# EAGLE design PicDisc-card (EAGLE 9.3.2)
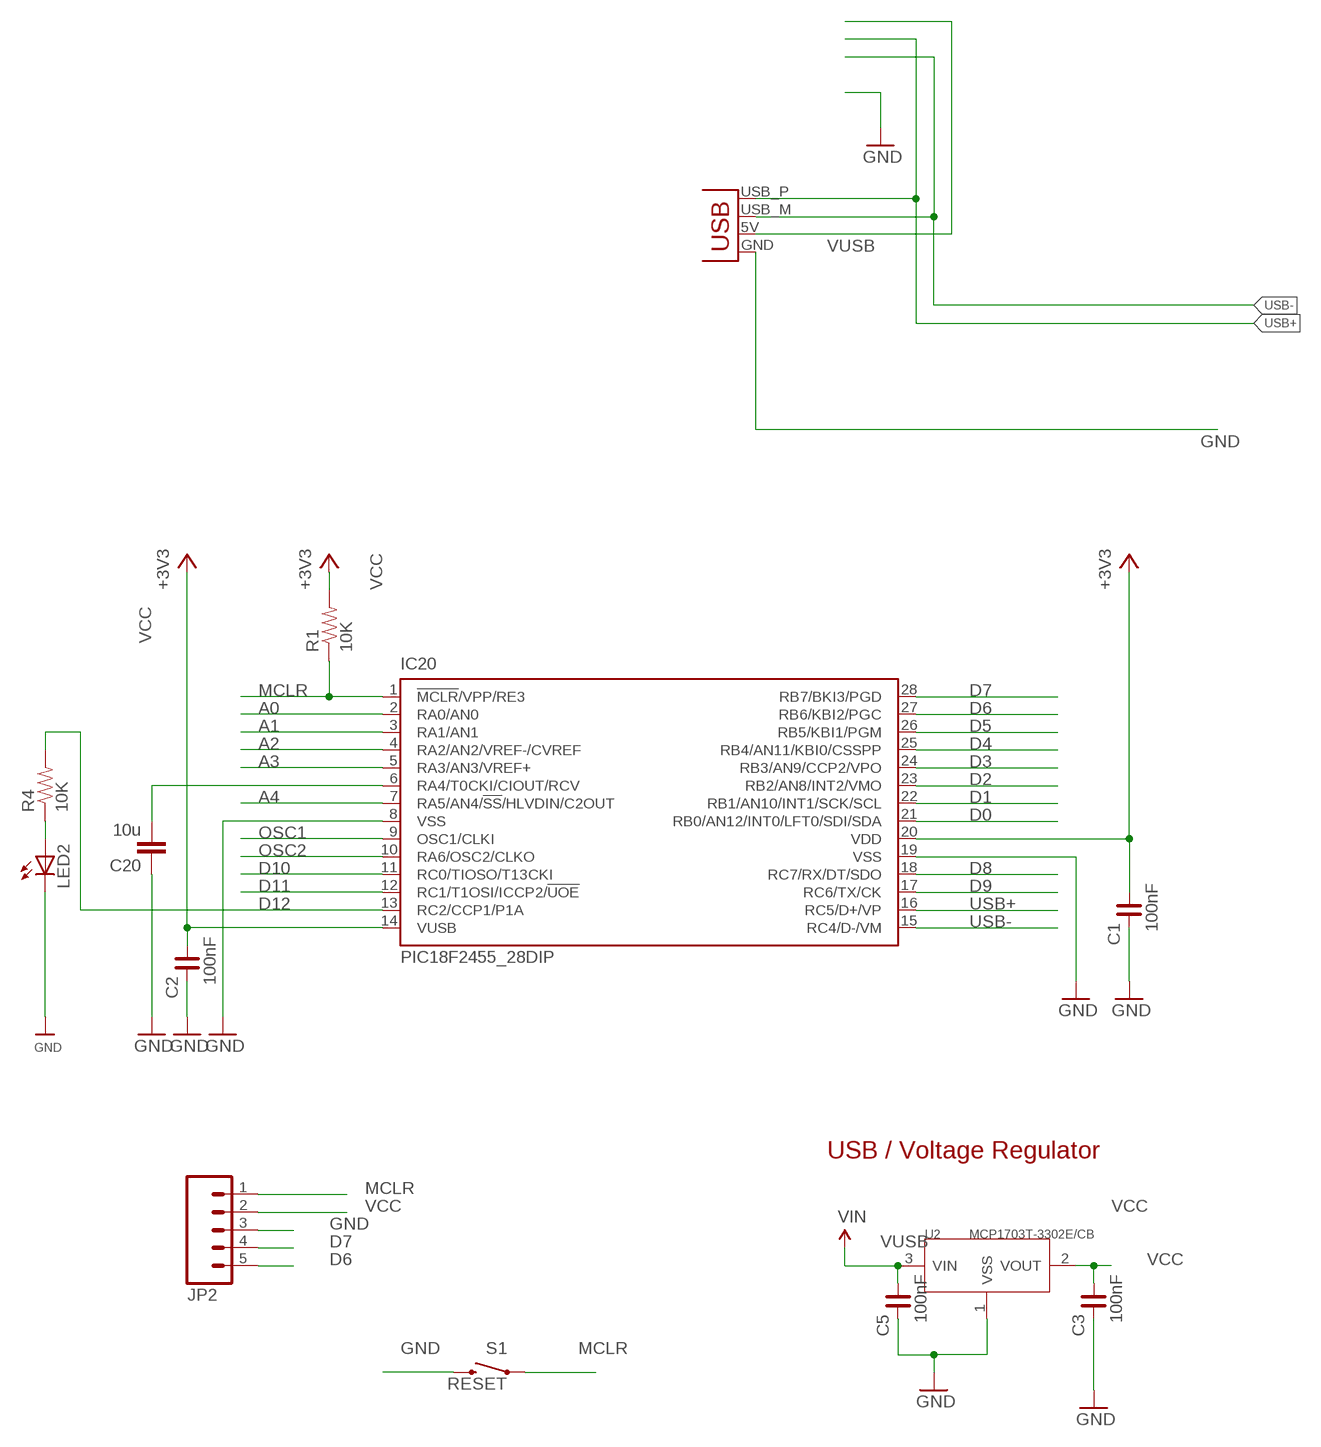
[diagram p0: schematic, sheet 1]

## Parts
C1  100nF  C_0603  [C0603]
C2  100nF  C_0603  [C0603]
C3  100nF  C_0603  [C0603]
C5  100nF  C_0603  [C0603]
C20  10u  CC0805  [C0805]
IC20  PIC18F2455_28DIP  [DIL28-3]
JP2  M05NO_SILK  [1X05_NO_SILK]
JP3  USBPCB  [USB-A-PCB]
LED2  LEDCHIPLED_0805  [CHIPLED_0805]
R1  10K  10KOHM-1/10W-1%(0603)0603  [0603-RES]
R4  10K  10KOHM-1/10W-1%(0603)0603  [0603-RES]
S1  RESET  SWITCH-MOMENTARY-2SMD-REDUNDANT  [TACTILE-SWITCH-SMD]
U2  MCP1703T-3302E/CB  XC6206  [SOT23]

## Nets
A0: IC20.2(RA0/AN0)
A1: IC20.3(RA1/AN1)
A2: IC20.4(RA2/AN2/VREF-/CVREF)
A3: IC20.5(RA3/AN3/VREF+)
A4: IC20.7(RA5/AN4/!SS!/HLVDIN/C2OUT)
D0: IC20.21(RB0/AN12/INT0/LFT0/SDI/SDA)
D1: IC20.22(RB1/AN10/INT1/SCK/SCL)
D2: IC20.23(RB2/AN8/INT2/VMO)
D3: IC20.24(RB3/AN9/CCP2/VPO)
D4: IC20.25(RB4/AN11/KBI0/CSSPP)
D5: IC20.26(RB5/KBI1/PGM)
D6: IC20.27(RB6/KBI2/PGC) JP2.5
D7: IC20.28(RB7/BKI3/PGD) JP2.4
D8: IC20.18(RC7/RX/DT/SDO)
D9: IC20.17(RC6/TX/CK)
D10: IC20.11(RC0/TIOSO/T13CKI)
D11: IC20.12(RC1/T1OSI/ICCP2/!UOE)
D12: IC20.13(RC2/CCP1/P1A) R4.2
GND [GND]: C1.2 C2.2 C3.2 C5.2 C20.1 IC20.8(VSS) IC20.19(VSS) JP2.3 JP3.GND LED2.C S1.3 S1.4 U2.1(VSS)
MCLR: IC20.1(!MCLR!/VPP/RE3) JP2.1 R1.1 S1.1 S1.2
N$1: LED2.A R4.1
N$15: C20.2 IC20.6(RA4/T0CKI/CIOUT/RCV)
OSC1: IC20.9(OSC1/CLKI)
OSC2: IC20.10(RA6/OSC2/CLKO)
USB+: IC20.16(RC5/D+/VP) JP3.USB_P(D+)
USB-: IC20.15(RC4/D-/VM) JP3.USB_M(D-)
VCC: C1.1 C2.1 C3.1 IC20.14(VUSB) IC20.20(VDD) JP2.2 R1.2 U2.2(VOUT) ; supply symbol labelled +3V3
VUSB: C5.1 JP3.5V(VBUS) U2.3(VIN) ; supply symbol labelled VIN

## Notes on the sheet
- USB / Voltage Regulator

## Library data of the parts
C1-C3 C5 = rc-master-smd:C_: NON-POLARIZED CAP
C20 = 00Capacitor:C: Capacitor
IC20 = microchip:PIC18F2*_28: USB Microcontrollers with nanoWatt Technology High-Performance, Enhanced Flash, 28/40/44-Pin, Source: http://ww1.microchip.com/downloads/en/devicedoc/39632c.pdf; MF: MICROCHIP; MPN: PIC18F2455-I/SP; OC_FARNELL: 1579600; OC_NEWARK: 01M8485
JP2 = SparkFun-Connectors:M05: Header 5 Standard 5-pin 0.1" header. Use with straight break away headers (SKU : PRT-00116), right angle break away headers (PRT-00553), swiss pins (PRT-00743), machine pins (PRT-00117), and female headers (PRT-00115). Molex polarized connector foot print use with SKU : PRT-08230 with associated crimp pins and housings.
JP3 = SparkFun-Connectors:USB: USB Connectors USB-B-PTH is fully proven SKU : PRT-00139/CONN-08278 USB-miniB is fully proven SKU : PRT-00587 USB-A-PCB is untested. USB-A-H is throughly reviewed, but untested. Spark Fun Electronics SKU : PRT-00437 USB-B-SMT is throughly reviewed, but untested. Needs silkscreen touching up. USB-A-S has not been used/tested USB-MB-H has not been used/tested USB-MICROB has been used. CONN-09505
LED2 = led:LED: LED OSRAM: - CHIPLED LG R971, LG N971, LY N971, LG Q971, LY Q971, LO R971, LY R971 LH N974, LH R974 LS Q976, LO Q976, LY Q976 LO Q996 - Hyper CHIPLED LW Q18S LB Q993, LB Q99A, LB R99A - SideLED LS A670, LO A670, LY A670, LG A670, LP A670 LB A673, LV A673, LT A673, LW A673 LH A674 LY A675 LS A676, LA A676, LO A676, LY A676, LW A676 LS A679, LY A679, LG A679 - Hyper Micro SIDELED® LS Y876, LA Y876, LO Y876, LY Y876 LT Y87S - SmartLED LW L88C, LW L88S LB L89C, LB L89S, LG L890 LS L89K, LO L89K, LY L89K LS L896, LA L896, LO L896, LY L896 - TOPLED LS T670, LO T670, LY T670, LG T670, LP T670 LSG T670, LSP T670, LSY T670, LOP T670, LYG T670 LG T671, LOG T671, LSG T671 LB T673, LV T673, LT T673, LW T673 LH T674 LS T676, LA T676, LO T676, LY T676, LB T676, LH T676, LSB T676, LW T676 LB T67C, LV T67C, LT T67C, LS T67K, LO T67K, LY T67K, LW E67C LS E67B, LA E67B, LO E67B, LY E67B, LB E67C, LV E67C, LT E67C LW T67C LS T679, LY T679, LG T679 LS T770, LO T770, LY T770, LG T770, LP T770 LB T773, LV T773, LT T773, LW T773 LH T774 LS E675, LA E675, LY E675, LS T675 LS T776, LA T776, LO T776, LY T776, LB T776 LHGB T686 LT T68C, LB T68C - Hyper Mini TOPLED® LB M676 - Mini TOPLED Santana® LG M470 LS M47K, LO M47K, LY M47K Source: http://www.osram.convergy.de LUXEON: - LUMILED® LXK2-PW12-R00, LXK2-PW12-S00, LXK2-PW14-U00, LXK2-PW14-V00 LXK2-PM12-R00, LXK2-PM12-S00, LXK2-PM14-U00 LXK2-PE12-Q00, LXK2-PE12-R00, LXK2-PE12-S00, LXK2-PE14-T00, LXK2-PE14-U00 LXK2-PB12-K00, LXK2-PB12-L00, LXK2-PB12-M00, LXK2-PB14-N00, LXK2-PB14-P00, LXK2-PB14-Q00 LXK2-PR12-L00, LXK2-PR12-M00, LXK2-PR14-Q00, LXK2-PR14-R00 LXK2-PD12-Q00, LXK2-PD12-R00, LXK2-PD12-S00 LXK2-PH12-R00, LXK2-PH12-S00 LXK2-PL12-P00, LXK2-PL12-Q00, LXK2-PL12-R00 Source: www.luxeon.com KINGBRIGHT: KA-3528ASYC Source: www.kingbright.com
R1 R4 = SparkFun-Resistors:10KOHM-1/10W-1%(0603): RES-00824; PROD_ID: RES-00824
S1 = SparkFun-Electromechanical:SWITCH-MOMENTARY-2: Various NO switches- pushbuttons, reed, etc; PROD_ID: SWCH-08247
U2 = xc6206:XC6206

## Net classes
0 default: width 0.203 mm, drill 0.356 mm, clearance 0.203 mm
1 vcc: width 0.203 mm, drill 0.356 mm, clearance 0.203 mm
2 GND: width 0.203 mm, drill 0.356 mm, clearance 0.203 mm

## Board
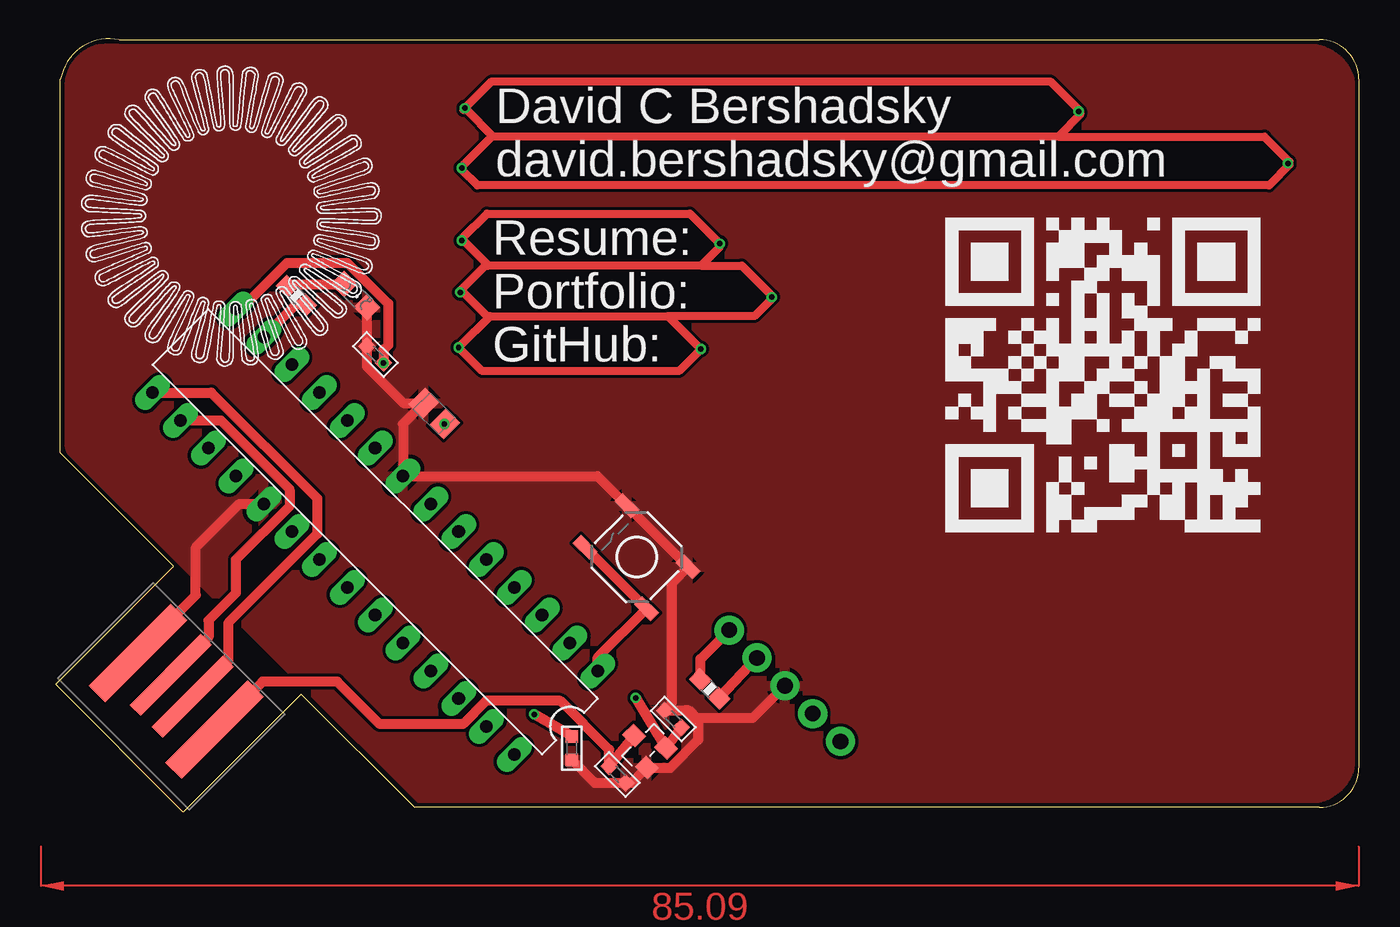
[diagram p1: board, top side]
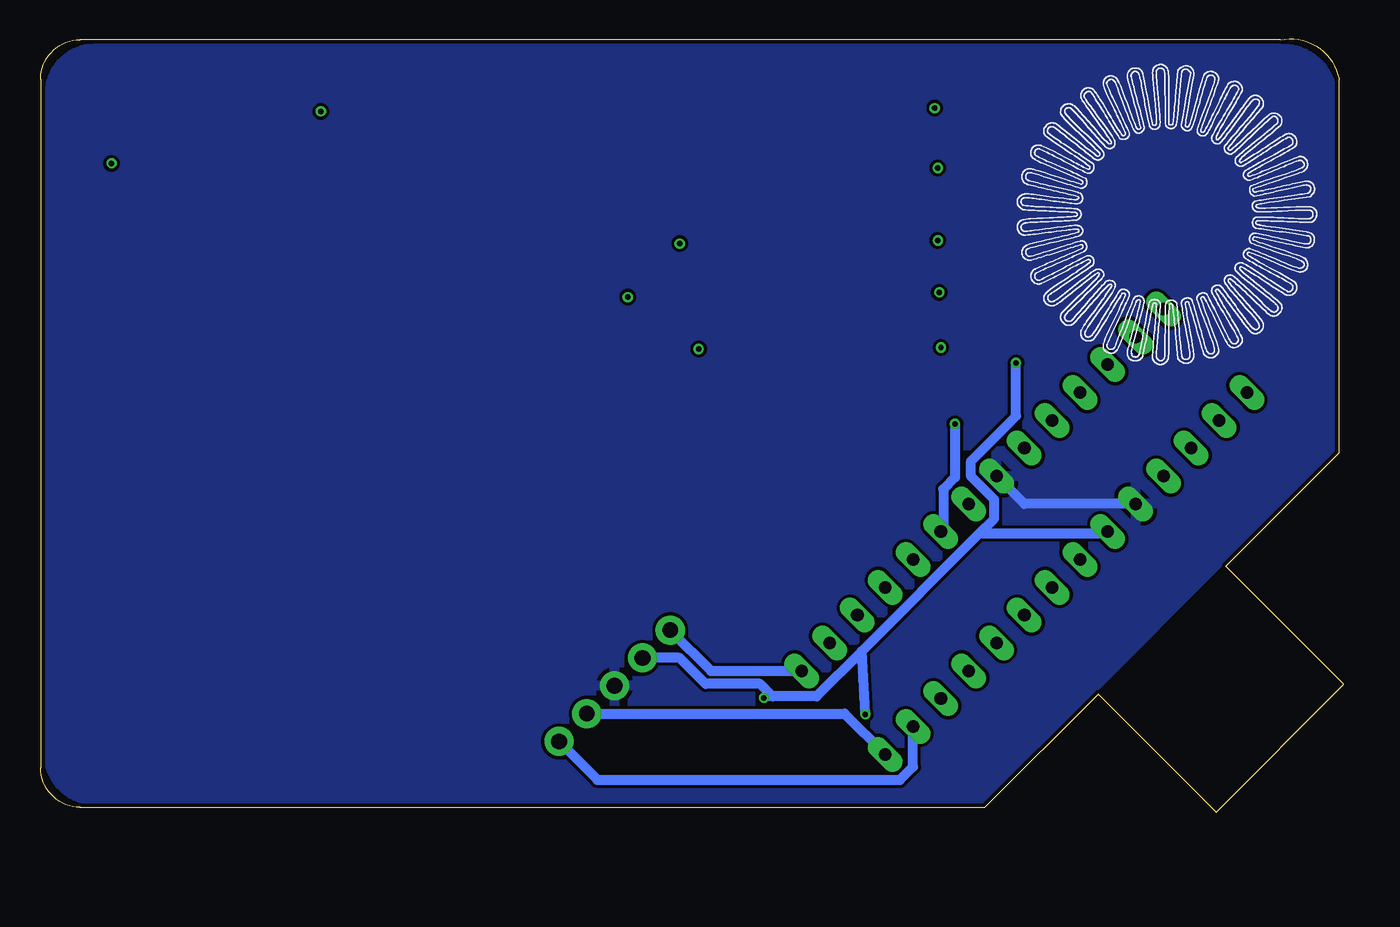
[diagram p2: board, bottom side, seen from below]

Size 84.14 x 49.91 mm. Coordinates in mm from the lower left corner, seen from the top.
Outline: 84.14,47.31 84.14,2.86 arc-90 81.6,0.32 23.18,0.32 15.88,7.62 8.25,0 0,8.26 7.62,15.87 0.32,23.18 0.32,47.31 arc-90 4.13,49.85 81.6,49.85 arc-90 84.14,47.31
Copper layers (1*16): Top 0.035mm / dielectric 1.5mm / Bottom 0.035mm
Design rules "dirt_cheap_dirty_boards.v1": minimum track width 5mil, minimum drill 12mil, track to track 5mil, track to pad 5mil, pad to pad 5mil, via to via 5mil, smd to smd 0mil, copper to edge 10mil, drill to drill 10mil, minimum pad ring 10mil, minimum via ring 6mil, stop-mask expansion 2mil, vias tented up to drill 25mil, thermal gap 10mil

### Footprints (pad centres in the part's own frame; a part is rotated, then mirrored left to right if it is on the bottom)
C0603 = smd 0.8 x 0.8: 1 -0.762,0; 2 0.762,0
C0805 = smd 1.3 x 1.5: 1 -0.95,0; 2 0.95,0
DIL28-3 = drill 0.813 long: 1 -16.51,-3.81; 2 -13.97,-3.81; 3 -11.43,-3.81; 4 -8.89,-3.81; 5 -6.35,-3.81; 6 -3.81,-3.81; 7 -1.27,-3.81; 8 1.27,-3.81; 9 3.81,-3.81; 10 6.35,-3.81; 11 8.89,-3.81; 12 11.43,-3.81; 13 13.97,-3.81; 14 16.51,-3.81; 15 16.51,3.81; 16 13.97,3.81; 17 11.43,3.81; 18 8.89,3.81; 19 6.35,3.81; 20 3.81,3.81; 21 1.27,3.81; 22 -1.27,3.81; 23 -3.81,3.81; 24 -6.35,3.81; 25 -8.89,3.81; 26 -11.43,3.81; 27 -13.97,3.81; 28 -16.51,3.81
1X05_NO_SILK = drill 1.016 pad 1.88: 1 0,0; 2 2.54,0; 3 5.08,0; 4 7.62,0; 5 10.16,0
USB-A-PCB = smd 7.5 x 1.5: 5V -0.2,-3.5; GND -0.2,3.5 | smd 6.5 x 1: USB_M 0.3,-1; USB_P 0.3,1
CHIPLED_0805 = smd 1.2 x 1.2: A 0,-1.05; C 0,1.05
0603-RES = smd 1.1 x 1: 1 -0.85,0; 2 0.85,0
TACTILE-SWITCH-SMD = smd 1.524 x 0.762: 1 -2.794,1.905; 2 2.794,1.905; 3 -2.794,-1.905; 4 2.794,-1.905
SOT23 = smd 1.016 x 1.143: 1 -0.889,-1.016; 2 0.889,-1.016; 3 0,1.016

### Placement (x,y rotation side)
C1  33.34,4.13 270 top
C2  20.64,29.53 135 top
C3  39.87,6.01 135 top
C5  36.28,2.42 315 top
C20  24.45,25.72 315 top
IC20  20.64,18.1 135 top
JP2  43.5,11.75 315 top
JP3  7.94,7.94 45 top
LED2  19.37,33.34 225 top
R1  42.23,7.94 315 top
R4  15.56,33.34 315 top
S1  37.52,16.46 135 top
U2  38.07,4.22 45 top

### Tracks (layer width: path | path; a pad name or v marks a point on that pad's centre or on a via)
D6
  Bottom 0.635: JP2.5 48.2,2.08 28.66,2.08 27.82,2.92 IC20.27 | JP2.5 | IC20.27
D7
  Bottom 0.635: JP2.4 32.25,6.36 IC20.28 | JP2.4 | IC20.28
D12
  Top 0.635: R4.2 15.52,32.74 IC20.13 | R4.2 | IC20.13
GND
  Top 0.635: 13.05,19.89 IC20.19 11.87,19.89 9.06,17.08 9.06,14 JP3.GND | JP3.GND | C5.2 36.81,1.87 34.83,1.87 C1.2 | IC20.8 34.98,21.69 S1.4 S1.3 39.75,14.74 39.75,6.98 C3.2 | IC20.8 22.43,25.05 C20.1 22.47,26.39 20.09,28.77 C2.2 | IC20.8 | LED2.C 20.1,32.58 C2.2 | LED2.C | C2.2 | C5.2 37.17,1.88 U2.1 38.19,2.84 39.68,2.84 41.49,4.66 41.49,5.69 40.62,6.56 | C5.2 | JP2.3 45.01,6.07 41.38,6.07 40.89,6.56 40.62,6.56 | JP2.3 | C3.2 | C3.2 40.62,6.56
  Bottom 0.635: IC20.19 20.64,19.89 IC20.8 | IC20.8
  pour Top: 0.93,23.58 0.93,46.95 arc-90 3.26,49.29 7.12,49.29 80.89,49.29 arc-90 83.63,46.55 83.63,44.62 83.63,16.07 83.63,3.57 arc-90 80.89,0.83 79.87,0.83 38.11,0.83 25.62,0.83 23.58,0.83 1.03,23.28
  pour Bottom: 0.83,23.38 23.48,0.62 arc-90 23.58,0.72 80.58,0.72 arc90 83.63,3.77 83.63,7.43 arc-90 83.53,7.53 83.53,46.44 arc90 80.68,49.29 77.13,49.29 3.98,49.29 arc90 0.72,46.04 0.72,23.38
MCLR
  Top 0.635: IC20.1 35.01,9.99 S1.1 | S1.1 | R1.1 41.63,9.88 JP2.1 | R1.1 | S1.2 S1.1 | S1.2 | S1.1
  Bottom 0.635: JP2.1 40.87,9.12 IC20.1
N$1
  Top 0.635: R4.1 15.1,34.08 LED2.A | R4.1 | LED2.A
N$2  (via drill 0.35)
  other vias: 26.43,45.43
N$3  (via drill 0.35)
  other vias: 66.05,45.22
N$4  (via drill 0.35)
  other vias: 26.23,41.57
N$5  (via drill 0.35)
  other vias: 79.57,41.87
N$6  (via drill 0.35)
  other vias: 26.23,36.89
N$8  (via drill 0.35)
  other vias: 26.02,29.98
N$10  (via drill 0.35)
  other vias: 46.24,33.24
N$12  (via drill 0.35)
  Top 0.508: 26.33,37.1 27.85,38.62 40.96,38.62 v42.89,36.69 42.89,36.49 41.67,35.27 | 41.67,35.27 27.95,35.27 | 27.95,35.27 26.33,36.89 | 26.12,33.64 27.75,35.27 27.95,35.27 | 41.67,35.27 44.31,35.27 46.34,33.24 45.12,32.02 39.54,32.02 | 28.05,32.02 27.85,32.02 26.33,33.54 v26.12,33.54 | 28.05,32.02 26.12,30.09 26.12,29.88 27.55,28.46 40.25,28.46 v41.67,29.88 39.54,32.02 | 28.05,32.02 39.54,32.02
N$14
  Top 0.508: 26.33,45.33 28.16,47.16 64.22,47.16 66.15,45.22 66.15,45.02 64.73,43.6 | 26.12,41.57 28.16,43.6 28.26,43.6 | 64.73,43.6 78.04,43.6 79.67,41.97 79.67,41.77 78.35,40.45 27.24,40.45 26.23,41.47 | 64.73,43.6 28.26,43.6 | 28.26,43.6 26.53,45.33
N$15  (via drill 0.36)
  Bottom 0.635: C20.2 25.12,21.61 25.88,20.85 25.88,18.25 IC20.6
  other vias: 25.12,25.05
USB+
  Top 0.635: IC20.16 10.67,25.28 15.1,20.85 15.1,19.75 11.64,16.29 11.64,14.14 9.88,12.38 9.88,11.3 JP3.USB_P | IC20.16
USB-
  Top 0.635: IC20.15 10.06,27.08 16.9,20.24 16.9,17.95 11.15,12.21 11.15,9.74 JP3.USB_M | IC20.15
VCC  (via drill 0.36)
  Top 0.635: IC20.14 11.97,32.47 14.95,35.45 18.84,35.45 21.48,32.81 21.48,30.14 21.18,29.84 C2.1 | v37.45,7.38 U2.2 C3.1 | JP2.2 R1.2 | C1.1 v30.9,6.31
  Bottom 0.635: IC20.20 15.4,17.95 23.57,17.95 | v37.45,7.38 37.36,7.47 36.89,7.47 | 36.89,7.47 34.05,7.47 31.12,10.4 | 23.57,17.95 31.12,10.4 | 36.89,7.47 37.7,8.28 41.21,8.28 42.89,9.95 JP2.2 | v30.9,6.31 31.12,10.4 | C2.1 21.18,25.55 24.08,22.65 24.08,21.67 22.58,20.17 22.58,18.94 23.57,17.95
  other vias: 21.18,28.99
VUSB
  Top 0.635: JP3.5V 13.37,8.42 18.19,8.42 20.94,5.67 26.3,5.67 27.8,7.17 32.59,7.17 35.74,4.03 C5.1 U2.3
(copper drawn outside any net)
  shapes: Top area x1

### Text on the board
tNames: David C Bershadsky / david.bershadsky@gmail.com | Resume: / Portfolio: / GitHub: